# EAGLE schematic datalogger (EAGLE 7.6.0)
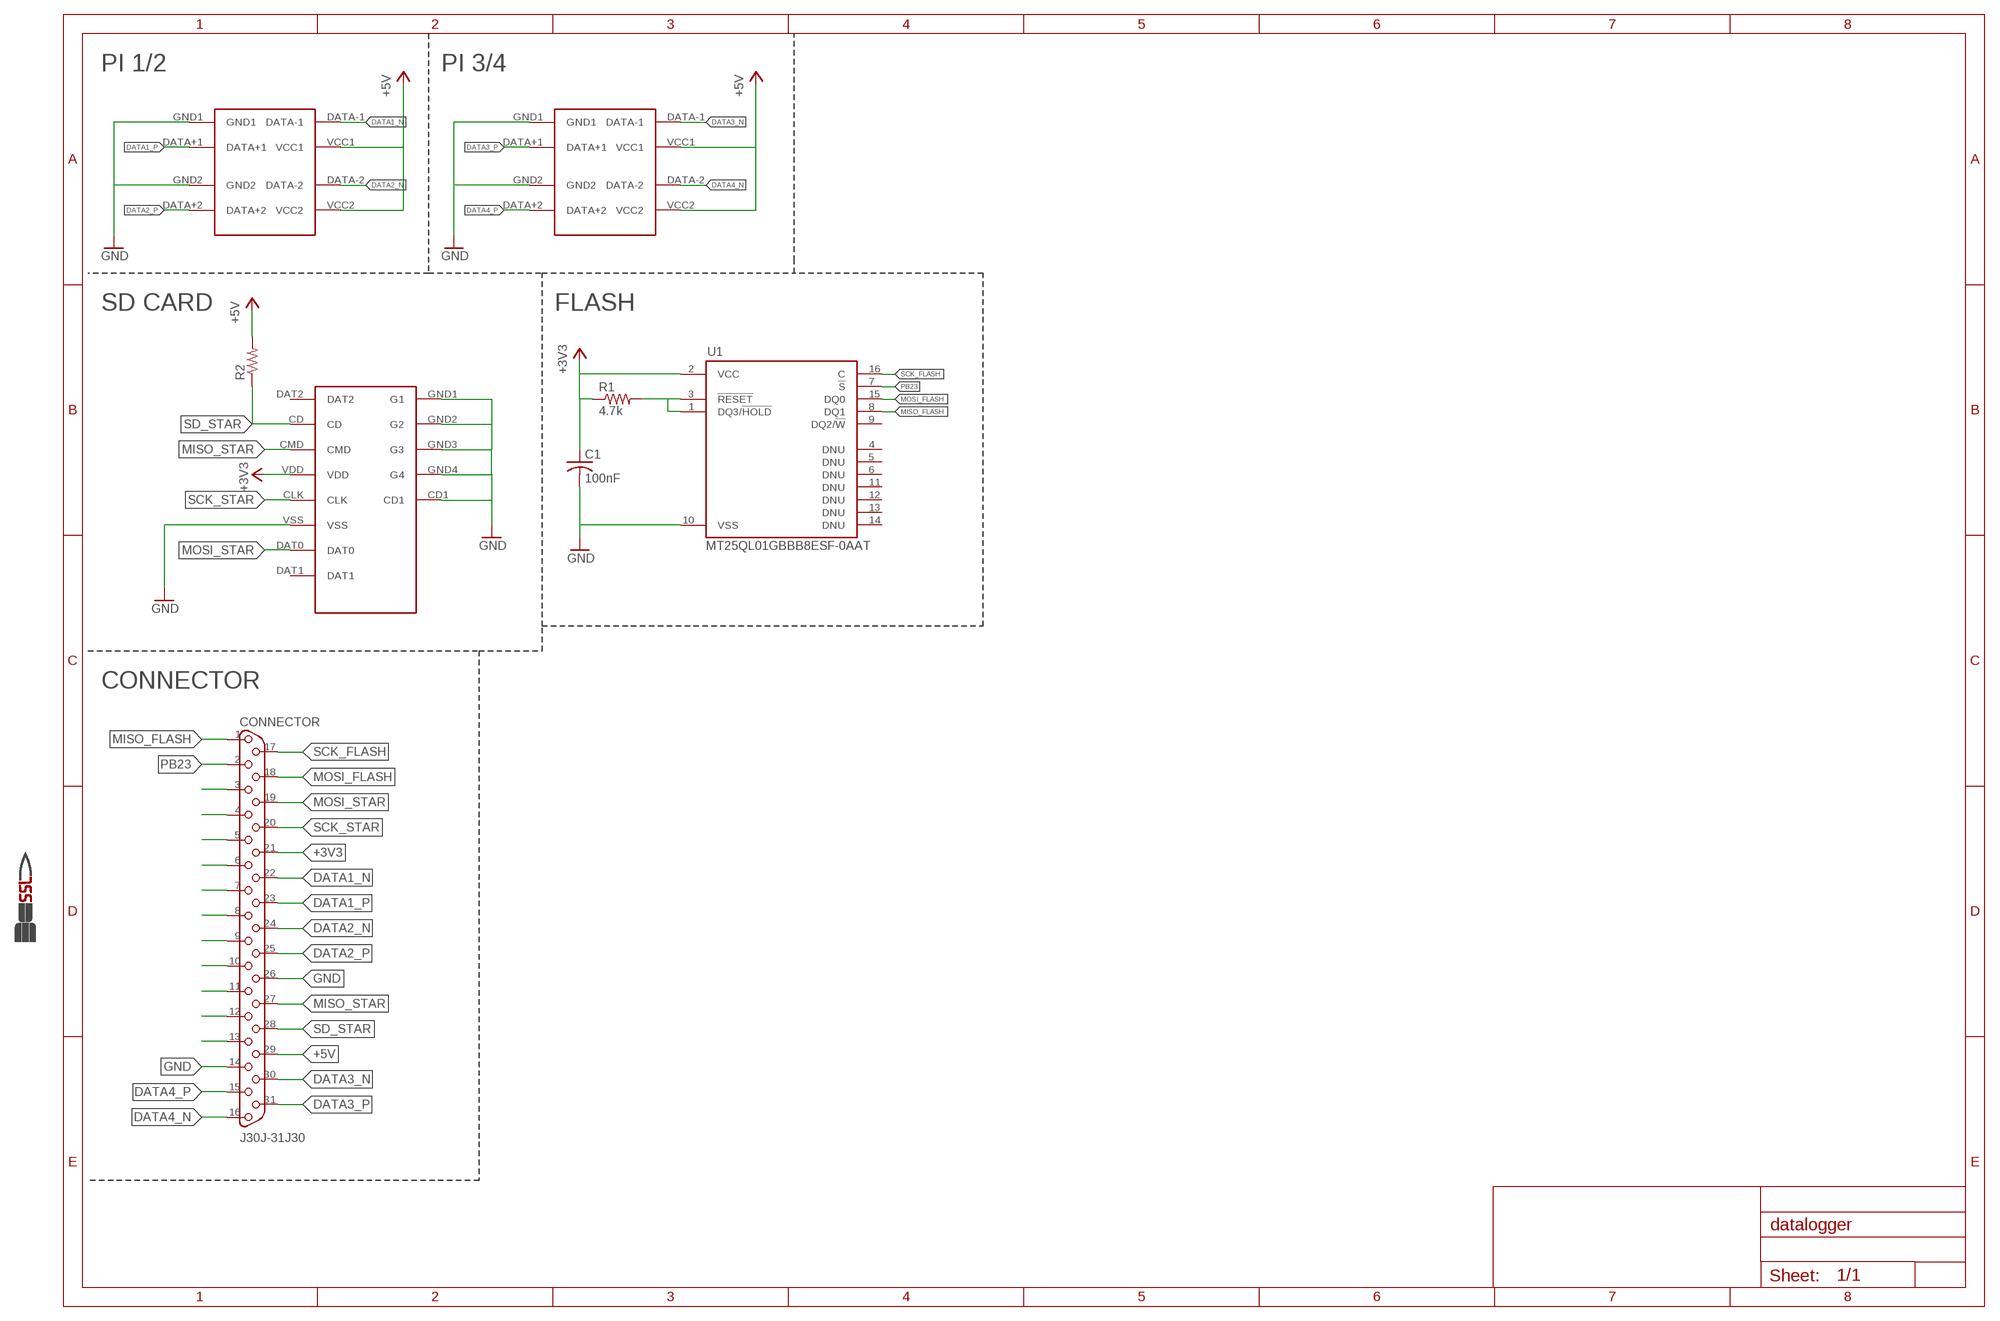
[diagram p0: schematic, sheet 1]

## Parts
C1  100nF  C-USC0603  [C0603]
CONNECTOR  J30J-31J30  [ZKN-31-J30]
R1  4.7k  R-US_R0603  [R0603]
R2  R-US_R0603  [R0603]
U1  MT25QL01GBBB8ESF-0AAT  [SOP2-16]
U$1  MICRO_SD  [MICRO_SD_HINGED]
U$2  USB_A  [USB_A]
U$3  USB_A  [USB_A]
U$4  SSL.3IN_SILK  [SSL_SILK_.3IN]

## Nets
+3V3: C1.1 CONNECTOR.21 R1.1 U1.2(VCC) U$1.VDD
+5V: CONNECTOR.29 R2.2 U$2.VCC1 U$2.VCC2 U$3.VCC1 U$3.VCC2
DATA1_N: CONNECTOR.22 U$2.DATA-1
DATA1_P: CONNECTOR.23 U$2.DATA+1
DATA2_N: CONNECTOR.24 U$2.DATA-2
DATA2_P: CONNECTOR.25 U$2.DATA+2
DATA3_N: CONNECTOR.30 U$3.DATA-1
DATA3_P: CONNECTOR.31 U$3.DATA+1
DATA4_N: CONNECTOR.16 U$3.DATA-2
DATA4_P: CONNECTOR.15 U$3.DATA+2
GND: C1.2 CONNECTOR.14 CONNECTOR.26 U1.10(VSS) U$1.CD1 U$1.GND1(G1) U$1.GND2(G2) U$1.GND3(G3) U$1.GND4(G4) U$1.VSS U$2.GND1 U$2.GND2 U$3.GND1 U$3.GND2
MISO_FLASH: CONNECTOR.1 U1.8(DQ1)
MISO_STAR: CONNECTOR.27 U$1.CMD
MOSI_FLASH: CONNECTOR.18 U1.15(DQ0)
MOSI_STAR: CONNECTOR.19 U$1.DAT0
N$1: R1.2 U1.1(DQ3/!HOLD!) U1.3(!RESET!)
N$2: CONNECTOR.3
N$3: CONNECTOR.4
N$4: CONNECTOR.5
N$5: CONNECTOR.6
N$6: CONNECTOR.7
N$7: CONNECTOR.8
N$8: CONNECTOR.9
N$9: CONNECTOR.10
N$10: CONNECTOR.11
N$11: CONNECTOR.12
N$12: CONNECTOR.13
PB23: CONNECTOR.2 U1.7(!S!)
SCK_FLASH: CONNECTOR.17 U1.16(C)
SCK_STAR: CONNECTOR.20 U$1.CLK
SD_STAR: CONNECTOR.28 R2.1 U$1.CD
Unconnected: U1.4(DNU) U1.5(DNU) U1.6(DNU) U1.9(DQ2/!W!) U1.11(DNU) U1.12(DNU) U1.13(DNU) U1.14(DNU) U$1.DAT1 U$1.DAT2

## Notes on the sheet
- PI 1/2 | PI 3/4
- SD CARD | FLASH
- CONNECTOR

## Library data of the parts
C1 = resistor:C-US: CAPACITOR, American symbol
CONNECTOR = CM_J30J:J30J-31
R1 R2 = resistor:R-US_: RESISTOR, American symbol
U1 = NR_IC:MT25QL01GBBB8ESF-0AAT
U$1 = NR_connectors:MICRO_SD
U$2 U$3 = NR_connectors:USB_A
U$4 = images:SSL

## Net classes
1 diff_pair: width 0.406 mm